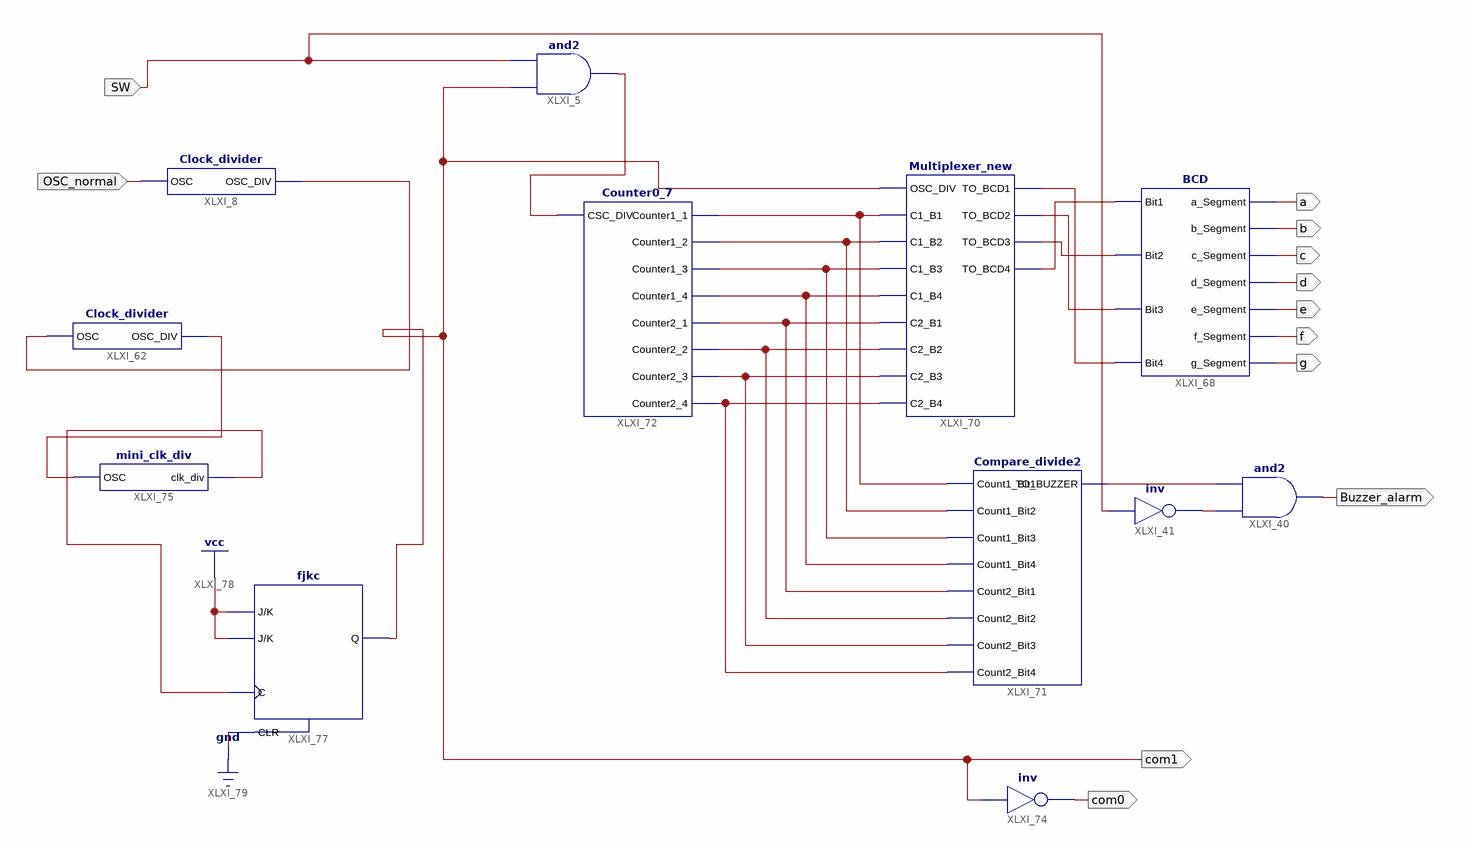
[diagram p0: schematic sheet 1]
// Xilinx ISE schematic Random00_99.sch (spartan6) as structural Verilog: 12 symbols, 12 ports
module Random00_99 (
  input  SW,
  input  OSC_normal,
  output Buzzer_alarm,
  output a,
  output b,
  output c,
  output d,
  output e,
  output f,
  output g,
  output com1,
  output com0
);

  wire XLXN_1, XLXN_173, XLXN_175, XLXN_228, XLXN_240, XLXN_241, XLXN_242, XLXN_243, XLXN_258, XLXN_259,
       XLXN_260, XLXN_261, XLXN_274, XLXN_275, XLXN_276, XLXN_277, XLXN_280, XLXN_282;

  Clock_divider XLXI_8 (.OSC(OSC_normal), .OSC_DIV(XLXN_228));
  and XLXI_5 (XLXN_1, com1, SW);
  and XLXI_40 (Buzzer_alarm, XLXN_173, XLXN_175);
  not XLXI_41 (XLXN_173, SW);
  Clock_divider XLXI_62 (.OSC(XLXN_228), .OSC_DIV(XLXN_280));
  BCD XLXI_68 (
    .Bit1(XLXN_261), .Bit2(XLXN_260), .Bit3(XLXN_259), .Bit4(XLXN_258), .a_Segment(a), .b_Segment(b),
    .c_Segment(c), .d_Segment(d), .e_Segment(e), .f_Segment(f), .g_Segment(g));
  Multiplexer_new XLXI_70 (
    .C1_B1(XLXN_240), .C1_B2(XLXN_241), .C1_B3(XLXN_242), .C1_B4(XLXN_243), .C2_B1(XLXN_274),
    .C2_B2(XLXN_275), .C2_B3(XLXN_276), .C2_B4(XLXN_277), .OSC_DIV(com1), .TO_BCD1(XLXN_258),
    .TO_BCD2(XLXN_259), .TO_BCD3(XLXN_260), .TO_BCD4(XLXN_261));
  Compare_divide2 XLXI_71 (
    .Count1_Bit1(XLXN_240), .Count1_Bit2(XLXN_241), .Count1_Bit3(XLXN_242), .Count1_Bit4(XLXN_243),
    .Count2_Bit1(XLXN_274), .Count2_Bit2(XLXN_275), .Count2_Bit3(XLXN_276), .Count2_Bit4(XLXN_277),
    .TO_BUZZER(XLXN_175));
  Counter0_7 XLXI_72 (
    .CSC_DIV(XLXN_1), .Counter1_1(XLXN_240), .Counter1_2(XLXN_241), .Counter1_3(XLXN_242),
    .Counter1_4(XLXN_243), .Counter2_4(XLXN_277), .Counter2_3(XLXN_276), .Counter2_2(XLXN_275),
    .Counter2_1(XLXN_274));
  not XLXI_74 (com0, com1);
  mini_clk_div XLXI_75 (.OSC(XLXN_280), .clk_div(XLXN_282));
  fjkc XLXI_77 (.C(XLXN_282), .CLR(1'b0), .J(1'b1), .K(1'b1), .Q(com1));
endmodule
